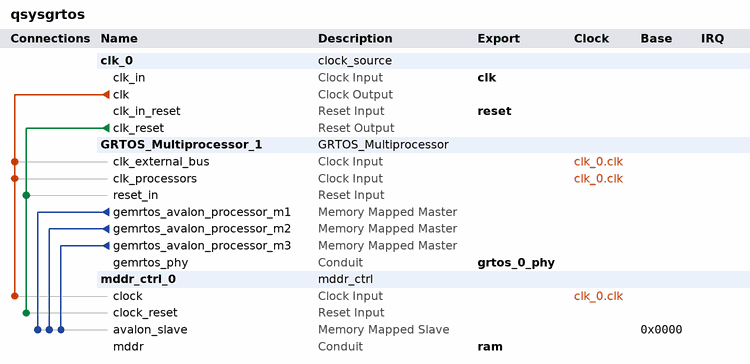
[diagram p0: system contents]
# Platform Designer (Qsys) system qsysgrtos, Cyclone IV E EP4CE22F17C7
# Parameters at their usual value, and those the tool derives, are not listed.
package require -exact qsys 18.0
create_system qsysgrtos
set_project_property DEVICE_FAMILY {Cyclone IV E}
set_project_property DEVICE EP4CE22F17C7

add_instance clk_0 clock_source 18.0
set_instance_parameter_value clk_0 clockFrequency 50000000

add_instance GRTOS_Multiprocessor_1 GRTOS_Multiprocessor 1.0
set_instance_parameter_value GRTOS_Multiprocessor_1 BUS_WIDTH 26
set_instance_parameter_value GRTOS_Multiprocessor_1 CEFrequency 50000000
set_instance_parameter_value GRTOS_Multiprocessor_1 CFrequency 50000000
set_instance_parameter_value GRTOS_Multiprocessor_1 ENABLE_HPS_MAP_ACCESS false
set_instance_parameter_value GRTOS_Multiprocessor_1 NProcessors 3
set_instance_parameter_value GRTOS_Multiprocessor_1 Processor_type {Nios II/e (economy)}
set_instance_parameter_value GRTOS_Multiprocessor_1 icache_burst_parameter Enable
set_instance_parameter_value GRTOS_Multiprocessor_1 icache_size_parameter {2 KB}

add_instance mddr_ctrl_0 mddr_ctrl 1.0
set_instance_parameter_value mddr_ctrl_0 pRefreshCount 780

# connections
add_connection clk_0.clk GRTOS_Multiprocessor_1.clk_external_bus clock
add_connection clk_0.clk GRTOS_Multiprocessor_1.clk_processors clock
add_connection clk_0.clk mddr_ctrl_0.clock clock
add_connection clk_0.clk_reset GRTOS_Multiprocessor_1.reset_in reset
add_connection clk_0.clk_reset mddr_ctrl_0.clock_reset reset
add_connection GRTOS_Multiprocessor_1.gemrtos_avalon_processor_m1 mddr_ctrl_0.avalon_slave avalon
set_connection_parameter_value GRTOS_Multiprocessor_1.gemrtos_avalon_processor_m1/mddr_ctrl_0.avalon_slave baseAddress 0x0000
add_connection GRTOS_Multiprocessor_1.gemrtos_avalon_processor_m2 mddr_ctrl_0.avalon_slave avalon
set_connection_parameter_value GRTOS_Multiprocessor_1.gemrtos_avalon_processor_m2/mddr_ctrl_0.avalon_slave baseAddress 0x0000
add_connection GRTOS_Multiprocessor_1.gemrtos_avalon_processor_m3 mddr_ctrl_0.avalon_slave avalon
set_connection_parameter_value GRTOS_Multiprocessor_1.gemrtos_avalon_processor_m3/mddr_ctrl_0.avalon_slave baseAddress 0x0000

# exported interfaces
add_interface clk clock sink
set_interface_property clk EXPORT_OF clk_0.clk_in
add_interface grtos_0_phy conduit end
set_interface_property grtos_0_phy EXPORT_OF GRTOS_Multiprocessor_1.gemrtos_phy
add_interface ram conduit end
set_interface_property ram EXPORT_OF mddr_ctrl_0.mddr
add_interface reset reset sink
set_interface_property reset EXPORT_OF clk_0.clk_in_reset

set_interconnect_requirement {$system} qsys_mm.clockCrossingAdapter HANDSHAKE
set_interconnect_requirement {$system} qsys_mm.enableEccProtection FALSE
set_interconnect_requirement {$system} qsys_mm.insertDefaultSlave FALSE
set_interconnect_requirement {$system} qsys_mm.maxAdditionalLatency 1

save_system qsysgrtos.qsys
